# EAGLE design 292mm-test1 (EAGLE 9.6.1)
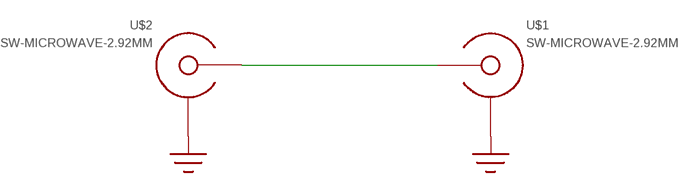
[diagram p0: schematic, sheet 1]

## Parts
U$1  SW-MICROWAVE-2.92MM  [SW-MICROWAVE-2.92MM]
U$2  SW-MICROWAVE-2.92MM  [SW-MICROWAVE-2.92MM]

## Nets
GND: U$1.SHIELD@1(SHIELD) U$1.SHIELD@2(SHIELD) U$1.SHIELD@3(SHIELD) U$2.SHIELD@1(SHIELD) U$2.SHIELD@2(SHIELD) U$2.SHIELD@3(SHIELD)
N$1 [22-6]: U$1.CENTER U$2.CENTER

## Library data of the parts
U$1 U$2 = yapo:SW-MICROWAVE-2.92MM

## Net classes
1 22-6: width 0.559 mm, clearance 0.152 mm

## Board
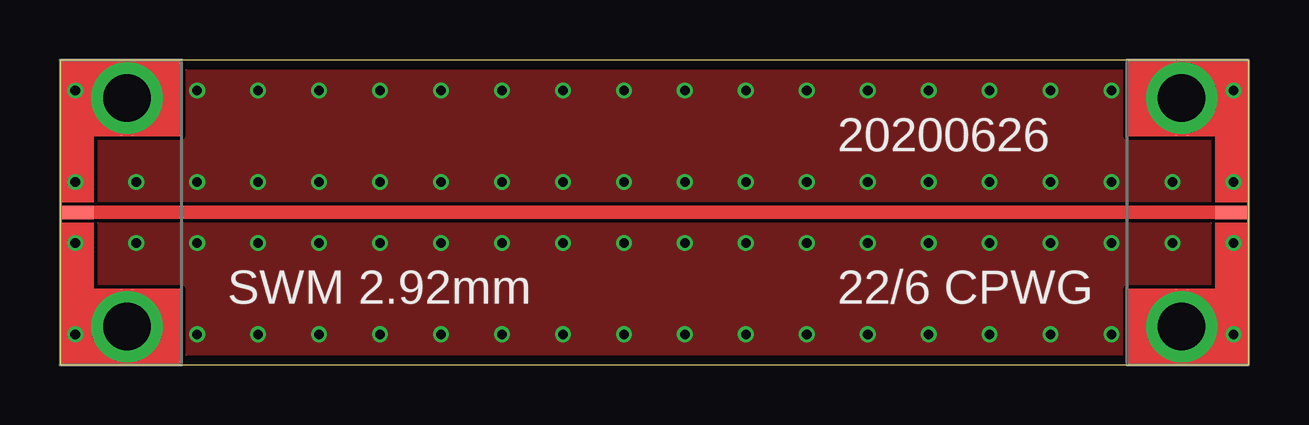
[diagram p1: board, top side]
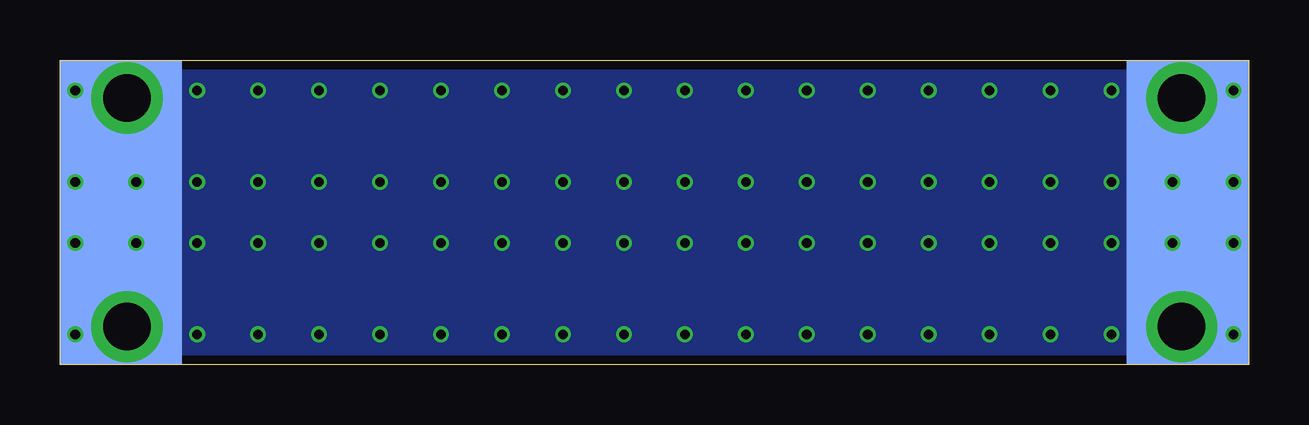
[diagram p2: board, bottom side, seen from below]

Size 49.53 x 12.7 mm. Coordinates in mm from the lower left corner, seen from the top.
Outline: 0,0 49.53,0 49.53,12.7 0,12.7 0,0
Copper layers (1*16): Top 0.035559375mm / dielectric 1.6mm / Bottom 0.035559375mm
Design rules "oshpark-2layer *": minimum track width 6mil, minimum drill 10mil, track to track 6mil, track to pad 6mil, pad to pad 6mil, via to via 6mil, smd to smd 6mil, copper to edge 15mil, drill to drill 6mil, minimum pad ring 5mil, minimum via ring 5mil, stop-mask expansion 2.5mil, vias tented up to drill 20mil, thermal gap 10mil

### Footprints (pad centres in the part's own frame; a part is rotated, then mirrored left to right if it is on the bottom)
SW-MICROWAVE-2.92MM = smd 0.559 x 1.397: CENTER 0,-0.699 | drill 1.981: SHIELD@1 -4.763,-2.794; SHIELD@2 4.763,-2.794 | smd 12.7 x 5.08 bottom: SHIELD@3 0,-2.54

### Placement (x,y rotation side)
U$1  49.53,6.35 270 top
U$2  0,6.35 90 top

### Tracks (layer width: path | path; a pad name or v marks a point on that pad's centre or on a via)
GND  (via drill 0.4)
  other vias: 0.64,7.62 0.64,5.08 3.17,7.62 5.71,7.62 8.26,7.62 10.79,7.62 13.34,7.62 15.88,7.62 18.41,7.62 20.95,7.62 23.5,7.62 26.04,7.62 28.57,7.62 31.11,7.62 33.66,7.62 36.2,7.62 38.73,7.62 41.27,7.62 43.81,7.62 46.35,7.62 3.17,5.08 5.71,5.08 8.26,5.08 10.79,5.08 13.34,5.08 15.88,5.08 18.41,5.08 20.95,5.08 23.5,5.08 26.04,5.08 28.57,5.08 31.11,5.08 33.66,5.08 36.2,5.08 38.73,5.08 41.27,5.08 43.81,5.08 46.35,5.08 48.9,7.62 48.9,5.08 0.64,11.43 5.71,11.43 8.26,11.43 10.79,11.43 13.34,11.43 15.88,11.43 18.41,11.43 20.95,11.43 23.5,11.43 26.04,11.43 28.57,11.43 31.11,11.43 33.66,11.43 36.2,11.43 38.73,11.43 41.27,11.43 43.81,11.43 48.9,11.43 0.64,1.27 5.71,1.27 8.26,1.27 10.79,1.27 13.34,1.27 15.88,1.27 18.41,1.27 20.95,1.27 23.5,1.27 26.04,1.27 28.57,1.27 31.11,1.27 33.66,1.27 36.2,1.27 38.73,1.27 41.27,1.27 43.81,1.27 48.9,1.27
  pour Bottom (no thermals): -3.17,15.88 50.16,15.88 50.16,-2.54 -3.17,-2.54
  pour Top (no thermals): -1.91,14.61 51.44,14.61 51.44,-1.27 -1.91,-1.27
N$1
  Top 0.559: U$2.CENTER U$1.CENTER

### Text on the board
tPlace: 20200626 | SWM 2.92mm | 22/6 CPWG